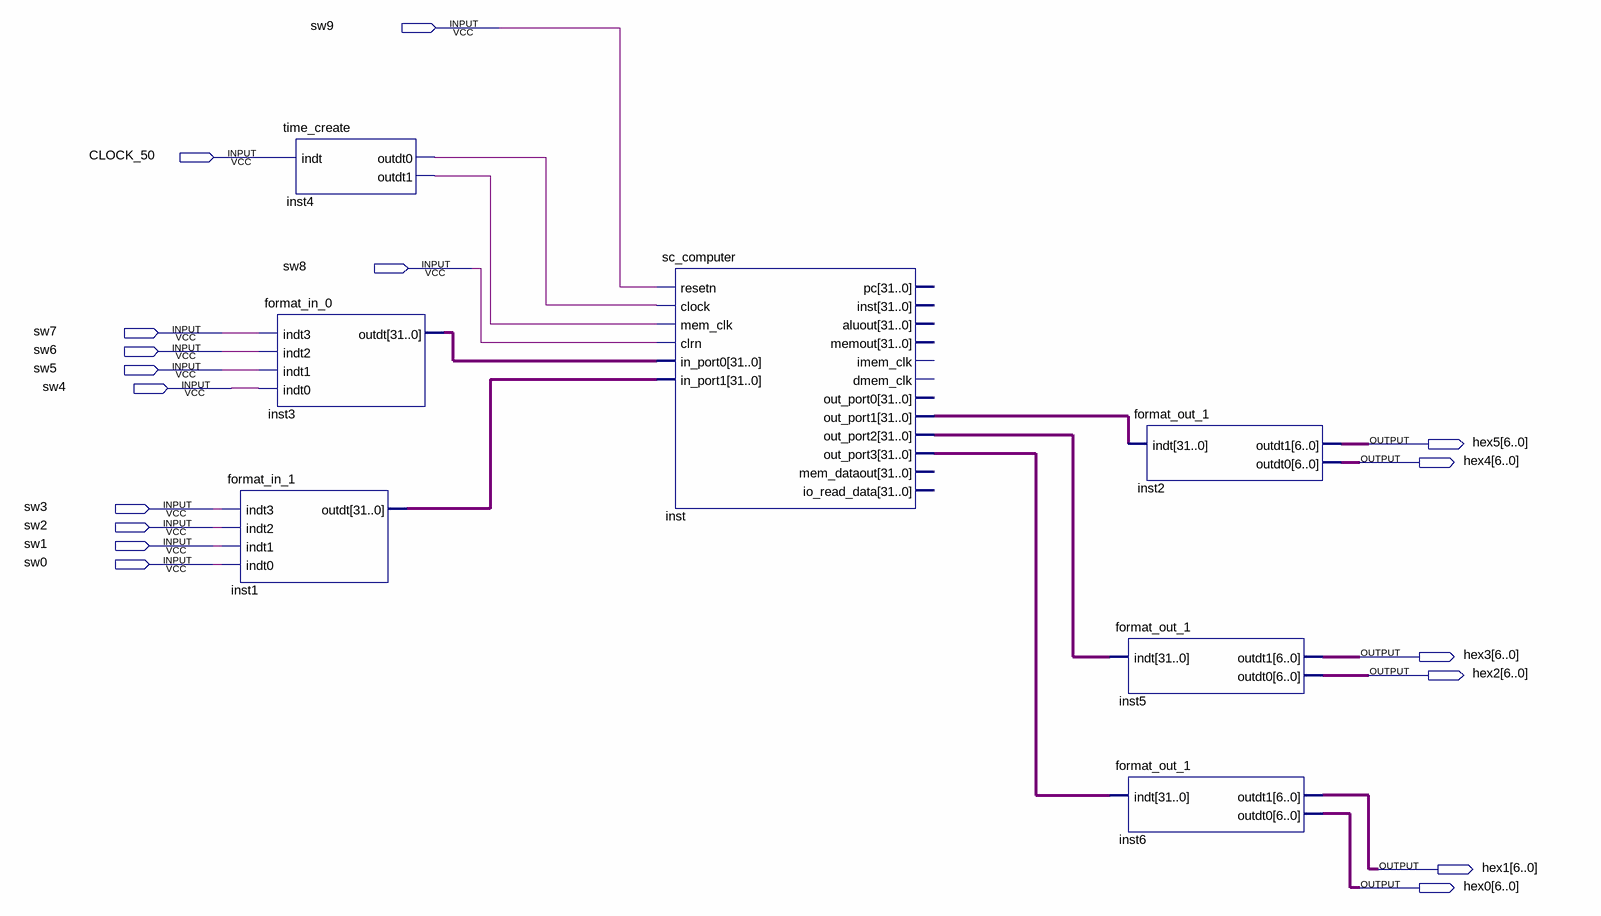
[diagram p0: schematic sheet]
// Quartus schematic sigle_computerio.bdf as structural Verilog: 7 symbols, 17 pins
module sigle_computerio (
  input  sw9,
  input  CLOCK_50,
  input  sw8,
  input  sw7,
  input  sw6,
  input  sw5,
  input  sw4,
  input  sw3,
  input  sw2,
  input  sw1,
  input  sw0,
  output [6:0] hex5,
  output [6:0] hex4,
  output [6:0] hex3,
  output [6:0] hex2,
  output [6:0] hex1,
  output [6:0] hex0
);

  wire inst4_outdt0, inst4_outdt1;
  wire [31:0] inst1_outdt, inst3_outdt, inst_out_port1, inst_out_port2, inst_out_port3;

  time_create inst4 (.indt(CLOCK_50), .outdt0(inst4_outdt0), .outdt1(inst4_outdt1));
  format_in_0 inst3 (.indt3(sw7), .indt2(sw6), .indt1(sw5), .indt0(sw4), .outdt(inst3_outdt));
  format_in_1 inst1 (.indt3(sw3), .indt2(sw2), .indt1(sw1), .indt0(sw0), .outdt(inst1_outdt));
  sc_computer inst (
    .resetn(sw9), .clock(inst4_outdt0), .mem_clk(inst4_outdt1), .clrn(sw8), .in_port0(inst3_outdt),
    .in_port1(inst1_outdt), .out_port1(inst_out_port1), .out_port2(inst_out_port2), .out_port3(inst_out_port3));  // open: pc, inst, aluout, memout, imem_clk, dmem_clk, out_port0, mem_dataout, io_read_data
  format_out_1 inst2 (.indt(inst_out_port1), .outdt1(hex5), .outdt0(hex4));
  format_out_1 inst5 (.indt(inst_out_port2), .outdt1(hex3), .outdt0(hex2));
  format_out_1 inst6 (.indt(inst_out_port3), .outdt1(hex1), .outdt0(hex0));
endmodule
